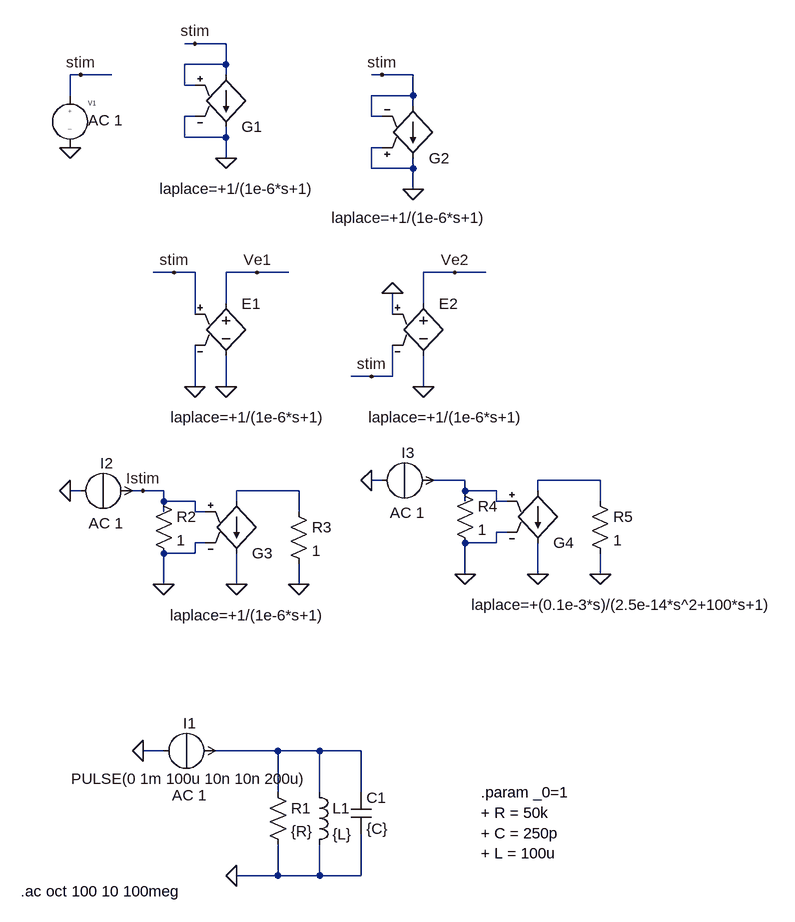
[diagram p0: schematic RLC_tf_matlab.asc]
RLC_tf_matlab.asc, the LTspice schematic file:
Version 4
SHEET 1 880 856
WIRE -64 -464 -80 -464
WIRE -16 -464 -64 -464
WIRE -16 -432 -16 -464
WIRE -16 -432 -80 -432
WIRE -240 -416 -256 -416
WIRE -192 -416 -240 -416
WIRE -16 -416 -16 -432
WIRE 224 -416 208 -416
WIRE 272 -416 224 -416
WIRE -80 -400 -80 -432
WIRE -64 -400 -80 -400
WIRE -256 -384 -256 -416
WIRE 272 -384 272 -416
WIRE 272 -384 208 -384
WIRE 272 -368 272 -384
WIRE -64 -352 -80 -352
WIRE 208 -352 208 -384
WIRE 224 -352 208 -352
WIRE -80 -320 -80 -352
WIRE -16 -320 -16 -336
WIRE -16 -320 -80 -320
WIRE 224 -304 208 -304
WIRE -16 -288 -16 -320
WIRE 208 -272 208 -304
WIRE 272 -272 272 -288
WIRE 272 -272 208 -272
WIRE 272 -240 272 -272
WIRE -96 -112 -128 -112
WIRE -64 -112 -96 -112
WIRE 32 -112 -16 -112
WIRE 80 -112 32 -112
WIRE 336 -112 288 -112
WIRE 384 -112 336 -112
WIRE -16 -64 -16 -112
WIRE 288 -64 288 -112
WIRE -64 -48 -64 -112
WIRE 240 -48 240 -80
WIRE 208 48 176 48
WIRE 240 48 240 0
WIRE 240 48 208 48
WIRE -64 64 -64 0
WIRE -16 64 -16 16
WIRE 288 64 288 16
WIRE 224 208 208 208
WIRE 352 208 304 208
WIRE 560 208 464 208
WIRE -240 224 -256 224
WIRE -144 224 -160 224
WIRE -112 224 -144 224
WIRE 96 224 0 224
WIRE 352 224 352 208
WIRE 400 224 352 224
WIRE 464 224 464 208
WIRE -112 240 -112 224
WIRE -64 240 -112 240
WIRE 0 240 0 224
WIRE 352 240 352 224
WIRE 400 240 400 224
WIRE 416 240 400 240
WIRE 560 240 560 208
WIRE -112 256 -112 240
WIRE -64 256 -64 240
WIRE -48 256 -64 256
WIRE 96 256 96 224
WIRE 416 288 400 288
WIRE -48 304 -64 304
WIRE 400 304 400 288
WIRE 400 304 352 304
WIRE -64 320 -64 304
WIRE -64 320 -112 320
WIRE 352 352 352 304
WIRE 464 352 464 304
WIRE 560 352 560 320
WIRE -112 368 -112 320
WIRE 0 368 0 320
WIRE 96 368 96 336
WIRE -112 624 -144 624
WIRE 64 624 -32 624
WIRE 128 624 64 624
WIRE 192 624 128 624
WIRE 64 688 64 624
WIRE 128 688 128 624
WIRE 192 688 192 624
WIRE 64 816 64 768
WIRE 64 816 0 816
WIRE 128 816 128 768
WIRE 128 816 64 816
WIRE 192 816 192 752
WIRE 192 816 128 816
FLAG -144 624 0
FLAG 0 816 0
FLAG 272 -240 0
FLAG -256 -304 0
FLAG 224 -416 stim
FLAG -240 -416 stim
FLAG -16 -288 0
FLAG -64 -464 stim
FLAG -16 64 0
FLAG -64 64 0
FLAG 32 -112 Ve1
FLAG -96 -112 stim
FLAG 288 64 0
FLAG 336 -112 Ve2
FLAG 208 48 stim
FLAG 240 -80 0
FLAG 0 368 0
FLAG -144 224 Istim
FLAG -256 224 0
FLAG 96 368 0
FLAG -112 368 0
FLAG 464 352 0
FLAG 208 208 0
FLAG 560 352 0
FLAG 352 352 0
SYMBOL res 48 672 R0
SYMATTR InstName R1
SYMATTR Value {R}
SYMBOL ind 112 672 R0
SYMATTR InstName L1
SYMATTR Value {L}
SYMBOL cap 176 688 R0
SYMATTR InstName C1
SYMATTR Value {C}
SYMBOL MDB_sym\\source-I -32 624 R90
WINDOW 0 -27 40 VBottom 2
WINDOW 3 27 40 VTop 2
WINDOW 123 53 40 VTop 2
WINDOW 39 0 0 Left 2
SYMATTR InstName I1
SYMATTR Value PULSE(0 1m 100u 10n 10n 200u)
SYMATTR Value2 AC 1
SYMBOL g 272 -272 M180
WINDOW 3 -126 -76 Left 2
SYMATTR InstName G2
SYMATTR Value laplace=+1/(1e-6*s+1)
SYMBOL MDB_sym\\source-V -256 -400 R0
WINDOW 123 28 54 Left 2
WINDOW 39 0 0 Left 2
SYMATTR InstName V1
SYMATTR Value ""
SYMATTR Value2 AC 1
SYMBOL e -16 -80 R0
WINDOW 3 -85 191 Left 2
SYMATTR InstName E1
SYMATTR Value laplace=+1/(1e-6*s+1)
SYMBOL g2 -16 -320 M180
WINDOW 3 -102 -79 Left 2
SYMATTR InstName G1
SYMATTR Value laplace=+1/(1e-6*s+1)
SYMBOL e 288 -80 R0
WINDOW 3 -85 191 Left 2
SYMATTR InstName E2
SYMATTR Value laplace=+1/(1e-6*s+1)
SYMBOL g2 0 336 M180
WINDOW 3 -102 -79 Left 2
SYMATTR InstName G3
SYMATTR Value laplace=+1/(1e-6*s+1)
SYMBOL res -128 224 R0
SYMATTR InstName R2
SYMATTR Value 1
SYMBOL MDB_sym\\source-I -160 224 R90
WINDOW 0 -27 40 VBottom 2
WINDOW 3 27 40 VTop 2
WINDOW 123 34 41 VTop 2
WINDOW 39 0 0 Left 2
SYMATTR InstName I2
SYMATTR Value ""
SYMATTR Value2 AC 1
SYMBOL res 80 240 R0
SYMATTR InstName R3
SYMATTR Value 1
SYMBOL g2 464 320 M180
WINDOW 3 -102 -79 Left 2
SYMATTR InstName G4
SYMATTR Value laplace=+(0.1e-3*s)/(2.5e-14*s^2+100*s+1)
SYMBOL res 336 208 R0
SYMATTR InstName R4
SYMATTR Value 1
SYMBOL res 544 224 R0
SYMATTR InstName R5
SYMATTR Value 1
SYMBOL MDB_sym\\source-I 304 208 R90
WINDOW 0 -27 40 VBottom 2
WINDOW 3 27 40 VTop 2
WINDOW 123 34 41 VTop 2
WINDOW 39 0 0 Left 2
SYMATTR InstName I3
SYMATTR Value ""
SYMATTR Value2 AC 1
TEXT 376 688 Left 2 !.param _0=1\n+ R = 50k\n+ C = 250p\n+ L = 100u
TEXT -332 840 Left 2 !.ac oct 100 10 100meg

The netlist it stands for:
* RLC_tf_matlab.asc
R1 N004 0 {R}
L1 N004 0 {L}
C1 N004 0 {C}
I1 0 N004 PULSE(0 1m 100u 10n 10n 200u) AC 1
G2 stim 0 0 stim laplace=+1/(1e-6*s+1)
V1 stim 0 AC 1
E1 Ve1 0 stim 0 laplace=+1/(1e-6*s+1)
G1 stim 0 stim 0 laplace=+1/(1e-6*s+1)
E2 Ve2 0 0 stim laplace=+1/(1e-6*s+1)
G3 N003 0 Istim 0 laplace=+1/(1e-6*s+1)
R2 Istim 0 1
I2 0 Istim AC 1
R3 N003 0 1
G4 N002 0 N001 0 laplace=+(0.1e-3*s)/(2.5e-14*s^2+100*s+1)
R4 N001 0 1
R5 N002 0 1
I3 0 N001 AC 1
.param _0=1
+ R = 50k
+ C = 250p
+ L = 100u
.ac oct 100 10 100meg
.backanno
.end